# EasyEDA Pro project 毕业设计.eprj, schematic Schematic1
Create Date: 2024-03-29; Page Name: P1; Project Name: 毕业设计; Schematic Name: Schematic1; Update Date: 2024-05-28; Company: 嘉立创EDA; Page Size: A4; Version: V1.0
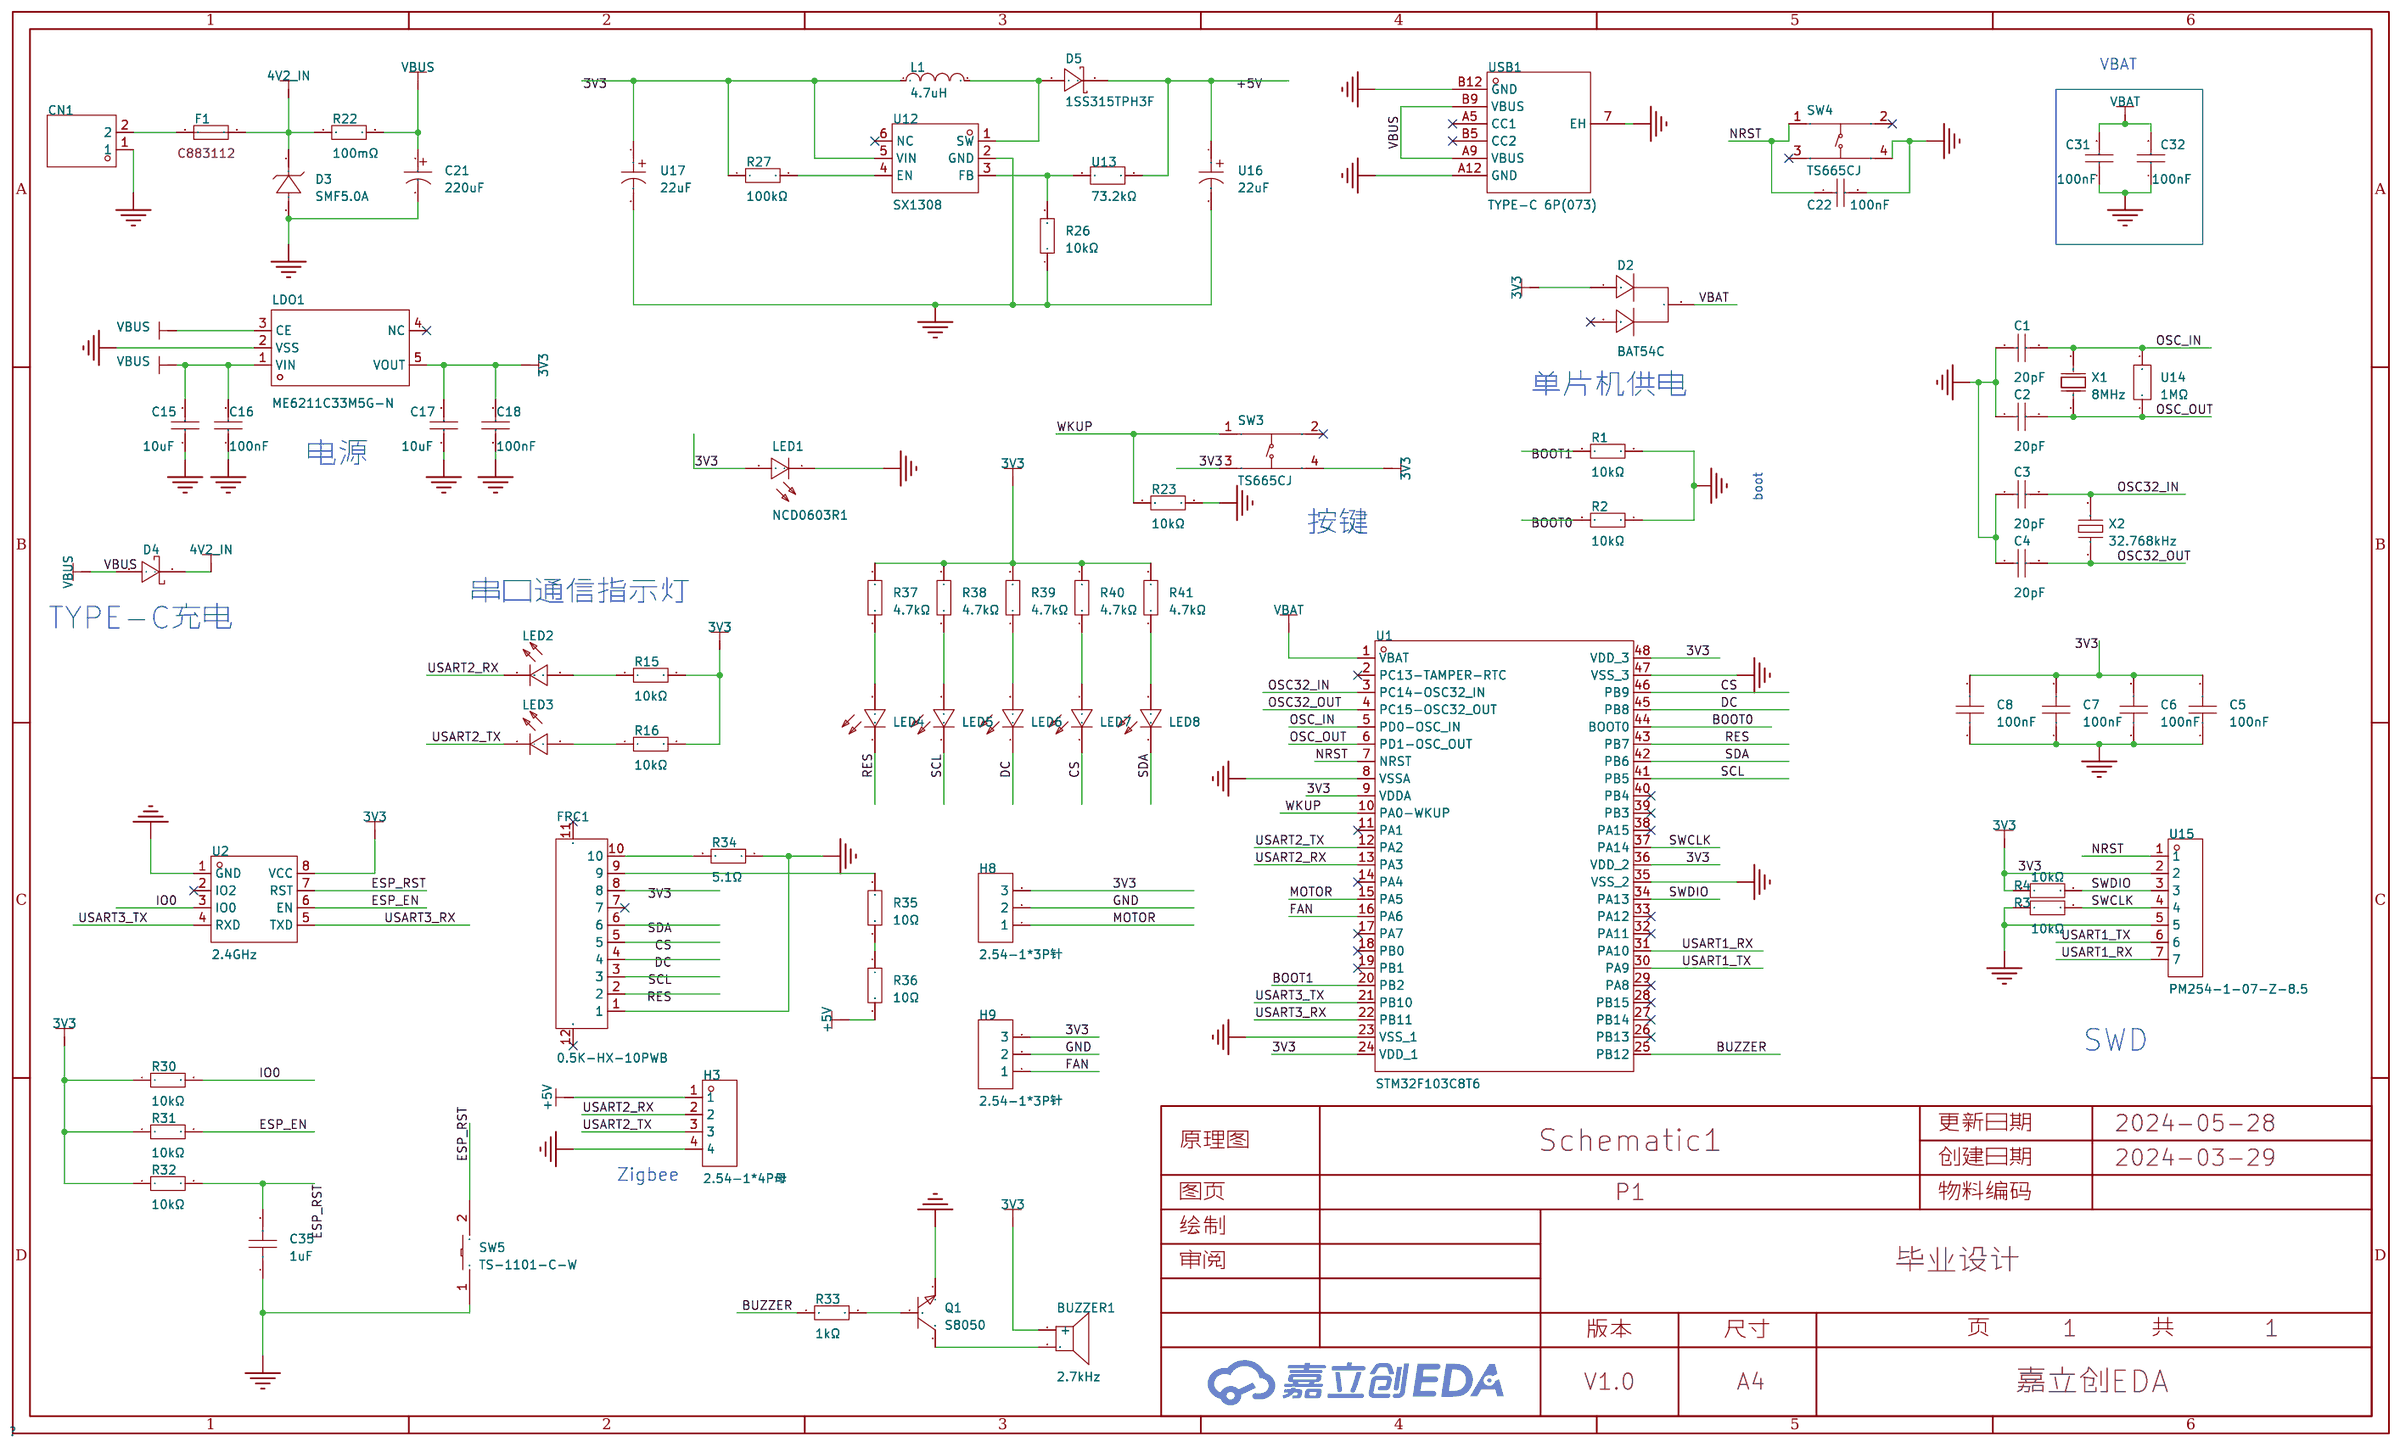
[diagram p0: schematic sheet]

## Parts
BUZZER1  2.7kHz  [BUZ-TH_BD12.0-P7.60-D0.6-FD]
C1  20pF  [C0603]
C2  20pF  [C0603]
C3  20pF  [C0603]
C4  20pF  [C0603]
C5  100nF  [C0603]
C6  100nF  [C0603]
C7  100nF  [C0603]
C8  100nF  [C0603]
C15  10uF  [C0402]
C16  100nF  [C0402]
C17  10uF  [C0402]
C18  100nF  [C0402]
C21  220uF  [CAP-TH_BD6.3-P2.50-D1.0-FD]
C22  100nF  [C0402]
C31  100nF  [C0603]
C32  100nF  [C0603]
C35  1uF  [C0603]
CN1  B2B-XH-A(LF)(SN)  [CONN-TH_B2B-XH-A-LF-SN]
D2  BAT54C  [SOT-23-3_L2.9-W1.6-P1.90-LS2.8-BR]
D3  SMF5.0A  [SOD-123FL_L2.7-W1.8-LS3.8-RD]
D4  B5819W SL  [SOD-123_L2.7-W1.6-LS3.7-RD-1]
D5  1SS315TPH3F  [SOD-323_L1.8-W1.3-LS2.5-RD]
F1  BSMD0805-100-6V  [F0805]
FPC1  0.5K-HX-10PWB  [FPC-SMD_10P-P0.50_HDGC_0.5K-HX-10PWB]
H3  2.54-1*4P母  [HDR-TH_4P-P2.54-V-F]
H8  2.54-1*3P针  [HDR-TH_3P-P2.54-V-M-1]
H9  2.54-1*3P针  [HDR-TH_3P-P2.54-V-M-1]
L1  4.7uH  [IND-SMD_L4.4-W4.2]
LDO1  ME6211C33M5G-N  [SOT-23-5_L3.0-W1.7-P0.95-LS2.8-BL]
LED1  NCD0603R1  [LED0603-RD_RED]
LED2  19-217/GHC-YR1S2/3T  [LED0603-RD]
LED3  NCD0603B1  [LED0603-RD]
LED4  NCD0603R1  [LED0603-RD_RED]
LED5  NCD0603R1  [LED0603-RD_RED]
LED6  NCD0603R1  [LED0603-RD_RED]
LED7  NCD0603R1  [LED0603-RD_RED]
LED8  NCD0603R1  [LED0603-RD_RED]
Q1  S8050  [SOT-23-3_L2.9-W1.3-P1.90-LS2.4-BR]
R1  10kΩ  [R0603]
R2  10kΩ  [R0603]
R3  10kΩ  [R0603]
R4  10kΩ  [R0603]
R15  10kΩ  [R0603]
R16  10kΩ  [R0603]
R22  100mΩ  [R0805]
R23  10kΩ  [R0603]
R26  10kΩ  [R0603]
R27  100kΩ  [R0402]
R30  10kΩ  [R0603]
R31  10kΩ  [R0603]
R32  10kΩ  [R0603]
R33  1kΩ  [R0603]
R34  5.1Ω  [R1206]
R35  10Ω  [R1206]
R36  10Ω  [R1206]
R37  4.7kΩ  [R0603]
R38  4.7kΩ  [R0603]
R39  4.7kΩ  [R0603]
R40  4.7kΩ  [R0603]
R41  4.7kΩ  [R0603]
SW3  TS665CJ  [SW-TH_4P-L6.0-W6.0-P4.50-LS6.5]
SW4  TS665CJ  [SW-TH_4P-L6.0-W6.0-P4.50-LS6.5]
SW5  TS-1101-C-W  [SW-SMD_L6.0-W3.3-LS8.0]
U1  STM32F103C8T6  [LQFP-48_L7.0-W7.0-P0.50-LS9.0-BL]
U2  2.4GHz  [WIFIM-TH_8P-L24.7-W14.4-P2.54]
U12  SX1308  [SOT-23-6_L2.9-W1.6-P0.95-LS2.8-BL]
U13  73.2kΩ  [R0603]
U14  1MΩ  [R0603]
U15  PM254-1-07-Z-8.5  [HDR-TH_7P-P2.54-V-F]
U16  22uF  [CAP-TH_BD4.0-P2.00-D0.5-FD]
U17  22uF  [CAP-TH_BD4.0-P2.00-D0.5-FD]
USB1  TYPE-C 6P(073)  [TYPE-C-SMD_TYPE-C-6P]
X1  8MHz  [CRYSTAL-SMD_L5.0-W3.2]
X2  32.768kHz  [OSC-SMD_L3.2-W1.5]

## Library data of the parts
BUZZER1 = TMB12A05_C96093: 驱动方式:有源(内含驱动线路);构造类型:电磁式;频率:2.7kHz;声压(SPL):85dB;; LCSC Part Name: TMB12A05; Supplier Part: C96093; Manufacturer: 华能; Manufacturer Part: TMB12A05; Supplier Footprint: 插件,D=12mm; JLCPCB Part Class: 扩展库; Datasheet: https://atta.szlcsc.com/upload/public/pdf/source/20230426/A4FC10532558AA232D532AB83455FBA4.pdf; Supplier: LCSC; Oscillator Circuit: 有源(内含驱动线路); Technology Type: 电磁式; Operating Voltage: 4V~8V; Sound Pressure Level (SPL): 85dB; Diameter (φD): 12mm; Height: 9.8mm
C1-C4 = CL10C200JB8NNNC: 容值:20pF;精度:±5%;额定电压:50V;材质(温度系数):C0G;; LCSC Part Name: 20pF ±5% 50V; Supplier Part: C1648; Manufacturer: SAMSUNG(三星); Supplier Footprint: 0603; JLCPCB Part Class: Basic Part; Datasheet: https://atta.szlcsc.com/upload/public/pdf/source/20160218/1457707763339.pdf; Supplier: LCSC; Tolerance: ±5%; Voltage Rated: 50V; Temperature Coefficient: C0G
C5-C8 = CC0603KRX7R9BB104: 容值:100nF;精度:±10%;额定电压:50V;材质(温度系数):X7R;; LCSC Part Name: 100nF ±10% 50V; Supplier Part: C14663; Manufacturer: YAGEO(国巨); Supplier Footprint: 0603; JLCPCB Part Class: Basic Part; Datasheet: https://atta.szlcsc.com/upload/public/pdf/source/20180910/C282072_33301C7F631E79921B82A8DAC6BCC5B3.pdf; Supplier: LCSC; Tolerance: ±10%; Voltage Rated: 50V; Temperature Coefficient: X7R
C15 C17 = CL05A106MQ5NUNC: 容值:10uF;精度:±20%;额定电压:6.3V;材质(温度系数):X5R;; LCSC Part Name: 10uF ±20% 6.3V; Supplier Part: C15525; Manufacturer: SAMSUNG(三星); Supplier Footprint: 0402; JLCPCB Part Class: Basic Part; Datasheet: https://atta.szlcsc.com/upload/public/pdf/source/20220823/2B02EE04F8F211D38A52DCB16EB6BEBA.pdf; Supplier: LCSC; Tolerance: ±20%; Voltage Rated: 6.3V; Temperature Coefficient: X5R
C16 C18 C22 = CL05B104KO5NNNC: 容值:100nF;精度:±10%;额定电压:16V;材质(温度系数):X7R;; LCSC Part Name: 100nF ±10% 16V; Supplier Part: C1525; Manufacturer: SAMSUNG(三星); Supplier Footprint: 0402; JLCPCB Part Class: Basic Part; Datasheet: https://atta.szlcsc.com/upload/public/pdf/source/20160103/1457707674891.pdf; Supplier: LCSC; Tolerance: ±10%; Voltage Rated: 16V; Temperature Coefficient: X7R
C21 = KM227M025E11RR0VH2FP0: 容值:220uF;精度:±20%;额定电压:25V;纹波电流:-;等效串联电阻:-;; LCSC Part Name: 220uF ±20% 25V; Supplier Part: C12450; Manufacturer: CX(承兴); Supplier Footprint: 插件,D6.3xL11mm; JLCPCB Part Class: Extended Part; Datasheet: https://atta.szlcsc.com/upload/public/pdf/source/20211027/06D6BA3719C264B639DC286D935D03EA.pdf; Supplier: LCSC; Tolerance: ±20%; Rated Voltage: 25V; φD: 6.3mm; L: 11mm; Lead Spacing: 2.5mm; Lifetime @ Temp: 1000hrs@105℃
C31 C32 = 0603B104K500NT: 容值:100nF;精度:±10%;额定电压:50V;材质(温度系数):X7R;; LCSC Part Name: 100nF ±10% 50V; Supplier Part: C30926; Manufacturer: FH(风华); Supplier Footprint: 0603; JLCPCB Part Class: Extended Part; Datasheet: https://atta.szlcsc.com/upload/public/pdf/source/20170923/C30926_1506149436298988724.pdf; Supplier: LCSC; Tolerance: ±10%; Voltage Rated: 50V; Temperature Coefficient: X7R
C35 = CL10A105KB8NNNC: 容值:1uF;精度:±10%;额定电压:50V;材质(温度系数):X5R;; LCSC Part Name: 1uF ±10% 50V; Supplier Part: C15849; Manufacturer: SAMSUNG(三星); Supplier Footprint: 0603; JLCPCB Part Class: 基础库; Datasheet: https://atta.szlcsc.com/upload/public/pdf/source/20160218/1457707763339.pdf; Supplier: LCSC; Tolerance: ±10%; Voltage Rated: 50V; Temperature Coefficient: X5R
CN1 = B2B-XH-A(LF)(SN): 参考系列:XH;间距:2.5mm;插针结构:1x2P;排数:1;每排PIN数:2;行距:-;安装方式:-;触头材质:黄铜;; LCSC Part Name: XH 2.5mm 1x2P; Supplier Part: C158012; Manufacturer: JST; Supplier Footprint: 插件,P=2.5mm; JLCPCB Part Class: Extended Part; Datasheet: https://atta.szlcsc.com/upload/public/pdf/source/20180319/9D0AC2122F92891443E3C996983D6D0E.pdf; Supplier: LCSC; Reference Series: XH; Pitch: 2.5mm; Pins Structure: 1x2P; Number of Rows: 1; Number of PINs Per Row: 2; Contact Material: 黄铜
D2 = BAT54C_C2135: 二极管配置:-;直流反向耐压(Vr):30V;平均整流电流(Io):200mA;正向压降(Vf):1V@100mA;; LCSC Part Name: 30V 200mA 1V@100mA; Supplier Part: C2135; Manufacturer: CJ(江苏长电/长晶); Supplier Footprint: SOT-23; JLCPCB Part Class: Extended Part; Datasheet: https://atta.szlcsc.com/upload/public/pdf/source/20140809/1457707208935.pdf; Supplier: LCSC; Reverse Voltage (Vr): 30V; Average Rectified Current (Io): 200mA; Forward Voltage (Vf@If): 1V@100mA
D3 = SMF5.0A_C908213: 极性:单向;反向截止电压(Vrwm):5V;击穿电压(最小值):6.4V;击穿电压(最大值):7.25V;反向漏电流(Ir):800uA;峰值脉冲电流(Ipp)@10/1000μs:21.7A;最大钳位电压:9.2V;; LCSC Part Name: 单向 Vrwm:5V; Supplier Part: C908213; Manufacturer: FUXINSEMI(富芯森美); Supplier Footprint: SOD-123; JLCPCB Part Class: Extended Part; Datasheet: https://atta.szlcsc.com/upload/public/pdf/source/20201023/C908211_2B6F82B5D5E79B5CF282141215A9A141.pdf; Supplier: LCSC; Polarity: 单向; Reverse Stand-Off Voltage (Vrwm): 5V; Breakdown Voltage (Min): 6.4V; Breakdown Voltage (Max): 7.25V; Reverse Leakage Current (Ir): 800uA; Peak Pulse Current (Ipp)@10/1000μs: 21.7A; Maximum Clamping Voltage: 9.2V
D4 = B5819W SL: 直流反向耐压(Vr):40V;平均整流电流(Io):1A;正向压降(Vf):600mV@1A;; LCSC Part Name: 40V 1A 600mV@1A; Supplier Part: C8598; Manufacturer: CJ(江苏长电/长晶); Supplier Footprint: SOD-123; JLCPCB Part Class: Basic Part; Datasheet: https://atta.szlcsc.com/upload/public/pdf/source/20170217/1487301580783.pdf; Supplier: LCSC; Reverse Voltage (Vr): 40V; Average Rectified Current (Io): 1A; Forward Voltage (Vf@If): 600mV@1A
D5 = 1SS315TPH3F: 二极管配置:独立式;正向压降(Vf):250mV@2mA;直流反向耐压(Vr):5V;平均整流电流(Io):30mA;; LCSC Part Name: 电压:5V 电流:30mA; Supplier Part: C146374; Manufacturer: TOSHIBA(东芝); Supplier Footprint: SC-76(SOD-323); JLCPCB Part Class: 扩展库; Datasheet: https://atta.szlcsc.com/upload/public/pdf/source/20171211/C146374_15129763897731175405.pdf; Supplier: LCSC; Diode Configuration: 独立式; Forward Voltage (Vf@If): 250mV@2mA; Reverse Voltage (Vr): 5V; Average Rectified Current (Io): 30mA
F1 = BSMD0805-100-6V: 最大电压:6V;最大电流:40A;保持电流:1A;跳闸电流:2A;; LCSC Part Name: 6V 1A 0805自恢复 300毫秒内动作; Supplier Part: C883112; Manufacturer: BHFUSE(佰宏); Supplier Footprint: 0805; JLCPCB Part Class: Extended Part; Datasheet: https://atta.szlcsc.com/upload/public/pdf/source/20220223/3FD8E8A8A3681642EAEF465E16495357.pdf; Supplier: LCSC; Operating Voltage (Max): 6V; Current Rating (Max): 40A; Hold Current: 1A; Trip Current: 2A; Power Dissipation: 500mW; Resistance - Initial (Ri) (Min): 40mΩ; Resistance - Post Trip (R1) (Max): 270mΩ; Maximum Time to Trip: 300ms; Operating Temperature: -40℃~+85℃
FPC1 = 0.5K-HX-10PWB: 锁定特性:翻盖式;触点类型:双侧触点/上下接;触点数量:10P;间距:0.5mm;安装类型:卧贴;工作温度范围:-55℃~+85℃;; LCSC Part Name: 间距:0.5mm P数:10P 翻盖式 双侧触点/上下接; Supplier Part: C2919493; Manufacturer: HDGC(华德共创); Supplier Footprint: SMD,P=0.5mm,卧贴; JLCPCB Part Class: 扩展库; Datasheet: https://atta.szlcsc.com/upload/public/pdf/source/20230106/F3A1E1364911D19E8EE51A6AD1F947C3.pdf; Supplier: LCSC; Locking Feature: 翻盖式; Contact Type: 双侧触点/上下接; Number of Contacts: 10P; Pitch: 0.5mm; Mounting Type: 卧贴; FFC, FCB Thickness: 0.3mm; Height Above Board: 1mm; Operating Temperature Range: -55℃~+85℃
H3 = 2.54-1*4P母: 插孔结构:1x4P;间距:2.54mm;行距:-;圆孔/方孔:方孔;安装类型:直插;排数:单排;总孔位数:4P;额定电流:3A;额定电压:-;插孔方向:顶部;塑高:-;触头材质:青铜;触头镀层:-;工作温度范围:-40℃~+105℃;焊接温度(最大值):-;; LCSC Part Name: 间距:2.54mm 1x4P 直插; Supplier Part: C2718488; Manufacturer: BOOMELE(博穆精密); Supplier Footprint: 插件,P=2.54mm; JLCPCB Part Class: Extended Part; Datasheet: https://atta.szlcsc.com/upload/public/pdf/source/20210301/C2718488_F4427B881E42CAA8DDB0B1C12B3A522C.pdf; Supplier: LCSC; Holes Structure: 1x4P; Pitch: 2.54mm; Circular Hole / Square Hole: 方孔; Mounting Type: 直插; Number of Rows: 单排; Number of Holes: 4P; Current Rating (Max): 3A; Holes Direction: 顶部; Contact Material: 青铜; Operating Temperature Range: -40℃~+105℃
H8 H9 = 2.54-1*3P针: 插针结构:1x3P;间距:2.54mm;行距:-;圆针/方针:方针;安装类型:直插;排数:单排;总PIN位数:3P;额定电流:3A;额定电压:-;配合针长度:-;塑高:-;端接针长度:-;触头材质:-;触头镀层:-;工作温度范围:-40℃~+105℃;颜色:黑色;; LCSC Part Name: 间距:2.54mm 1x3P 直插 方针; Supplier Part: C49257; Manufacturer: BOOMELE(博穆精密); Supplier Footprint: 插件,P=2.54mm; JLCPCB Part Class: Extended Part; Datasheet: https://atta.szlcsc.com/upload/public/pdf/source/20221018/3E9408392E35E6F57A28985E5F7BF5C9.pdf; Supplier: LCSC; Pin Structure: 1x3P; Pitch: 2.54mm; Circluar Pins/Square Pins: 方针; Mounting Type: 直插; Number of Rows: 单排; Number of Pins: 3P; Current Rating (Max): 3A; Operating Temperature Range: -40℃~+105℃; Color: 黑色
L1 = FXL0420-4R7-M: 电感值:4.7uH;精度:±20%;额定电流:2.8A;饱和电流(Isat):3A;类型:一体成型电感;; LCSC Part Name: 4.7uH ±20% 3A; Supplier Part: C167208; Manufacturer: cjiang(长江微电); Supplier Footprint: SMD,4.2x4.4mm; JLCPCB Part Class: Extended Part; Datasheet: https://atta.szlcsc.com/upload/public/pdf/source/20230516/FBADA9890E7FBE97C620F1D8B562D733.pdf; Supplier: LCSC; Tolerance: ±20%; Rated Current: 2.8A; Saturation Current (Isat): 3A; DC Resistance (DCR): 105mΩ; Type: 一体成型电感
LDO1 = ME6211C33M5G-N: 输出类型:固定;输出极性:正;最大输入电压:6V;输出电压:3.3V;输出电流:500mA;电源纹波抑制比(PSRR):70dB;; Supplier Part: C82942; Manufacturer: MICRONE(南京微盟); Supplier Footprint: SOT-23-5; JLCPCB Part Class: Extended Part; Datasheet: https://atta.szlcsc.com/upload/public/pdf/source/20170918/C82942_1505727073070976520.pdf; Supplier: LCSC; Output Type: 固定; Output Polarity: 正; Number of Outputs: 1; Maximum Input Voltage: 6V; Output Voltage: 3.3V; Dropout Voltage: 260mV@(200mA); Output Current: 500mA; Power Supply Rejection Ratio (PSRR): 70dB
LED1 LED4-LED8 = NCD0603R1_C84263: 灯头类型:-;发光颜色:红色;正向电压(VF):1.6V~2.6V;功率:65mW;正向电流:20mA;主波长:615nm~630nm;二极管配置:独立二极管;透镜颜色:无色透明透镜;色温:-;发光强度:80mcd~220mcd;发光角度:130°;载带方式:-;工作温度:-30℃~+85℃;; Supplier Part: C84263; Manufacturer: 国星光电; Supplier Footprint: 0603; JLCPCB Part Class: 扩展库; Datasheet: https://atta.szlcsc.com/upload/public/pdf/source/20200820/C84263_DABC6A75E58F576973B407FDBA283D60.pdf; Supplier: LCSC; Emitted Color: 红色; Forward Voltage (VF): 1.6V~2.6V; Power Dissipation: 65mW; Forward Current: 20mA; Dominant Wavelength: 615nm~630nm; Diode Configuration: 独立二极管; Lens Color: 无色透明透镜; Luminous Intensity: 80mcd~220mcd; Viewing Angle: 130°; Operating Temperature: -30℃~+85℃
LED2 = 19-217/GHC-YR1S2/3T: 发光颜色:翠绿;二极管配置:-;主波长:520nm~535nm;色温:-;功率:110mW;安装方式:-;; Supplier Part: C72043; Manufacturer: EVERLIGHT(亿光); Supplier Footprint: 0603; JLCPCB Part Class: Basic Part; Datasheet: https://atta.szlcsc.com/upload/public/pdf/source/20160507/1462613613780.pdf; Supplier: LCSC; Emitted Color: 翠绿; Lens Color: 无色透明; Dominant Wavelength: 520nm~535nm; Peak Wavelength: 518nm; Forward Current: 20mA; Power Dissipation: 110mW; Viewing Angle: 120°; Operating Temperature: -40℃~+85℃
LED3 = NCD0603B1: 发光颜色:蓝灯;; LCSC Part Name: 蓝灯; Supplier Part: C84266; Manufacturer: 国星光电; Supplier Footprint: 0603; JLCPCB Part Class: Extended Part; Datasheet: https://atta.szlcsc.com/upload/public/pdf/source/20200820/C84266_6A3CDBEFA72C6CAD68EDA53474ADAE6C.pdf; Supplier: LCSC; Emitted Color: 蓝灯
Q1 = S8050_C2891804: 晶体管类型:NPN;集电极电流(Ic):500mA;集射极击穿电压(Vceo):25V;功率(Pd):300mW;; LCSC Part Name: NPN 电流:500mA 耐压:25V; Supplier Part: C2891804; Manufacturer: YONGYUTAI(永裕泰); Supplier Footprint: SOT-23; JLCPCB Part Class: 扩展库; Datasheet: https://atta.szlcsc.com/upload/public/pdf/source/20210901/5347316A10609C628D4D69AE01446E5B.pdf; Supplier: LCSC; Transistor Type: NPN; Collector Current (Ic): 500mA; Collector-Emitter Breakdown Voltage (Vceo): 25V; Power Dissipation (Pd): 300mW; Collector Cut-Off Current (Icbo): 1uA; Collector-Emitter Saturation Voltage (VCE(sat)@Ic,Ib): 500mV@500mA,50mA
R1 R2 R26 R30-R32 = 0603WAF1002T5E: 电阻类型:厚膜电阻;阻值:10kΩ;精度:±1%;功率:100mW;最大工作电压:75V;温度系数:±100ppm/℃;; LCSC Part Name: 厚膜电阻 10kΩ ±1% 100mW; Supplier Part: C25804; Manufacturer: UNI-ROYAL(厚声); Supplier Footprint: 0603; JLCPCB Part Class: Basic Part; Datasheet: https://atta.szlcsc.com/upload/public/pdf/source/20200306/C422600_1E6D84923E4A46A82E41ADD87F860B5C.pdf; Supplier: LCSC; Type: 厚膜电阻; Tolerance: ±1%; Power(Watts): 100mW; Overload Voltage (Max): 75V; Temperature Coefficient: ±100ppm/℃; Operating Temperature Range: -55℃~+155℃
R3 R4 R15 R16 R23 = 0603WAF1002T5E: 电阻类型:厚膜电阻;阻值:10kΩ;精度:±1%;功率:100mW;; LCSC Part Name: 厚膜电阻 10kΩ ±1% 100mW; Supplier Part: C25804; Manufacturer: UNI-ROYAL(厚声); Supplier Footprint: 0603; JLCPCB Part Class: Basic Part; Datasheet: https://atta.szlcsc.com/upload/public/pdf/source/20200306/C422600_1E6D84923E4A46A82E41ADD87F860B5C.pdf; Supplier: LCSC; Type: 厚膜电阻; Tolerance: ±1%; Power(Watts): 100mW; Overload Voltage (Max): 75V; Temperature Coefficient: ±100ppm/℃; Operating Temperature Range: -55℃~+155℃
R22 = 0805W8F100LT5E: 阻值:100mΩ;精度:±1%;功率:125mW;; LCSC Part Name: 100mΩ ±1% 125mW; Supplier Part: C127687; Manufacturer: UNI-ROYAL(厚声); Supplier Footprint: 0805; JLCPCB Part Class: Extended Part; Datasheet: https://atta.szlcsc.com/upload/public/pdf/source/20170821/C127687_1503303433318901668.pdf; Supplier: LCSC; Tolerance: ±1%; Power(Watts): 125mW; Temperature Coefficient: ±800ppm/℃
R27 = RC0402FR-07100KL: 电阻类型:厚膜电阻;阻值:100kΩ;精度:±1%;功率:62.5mW;最大工作电压:50V;温度系数:±100ppm/℃;; LCSC Part Name: 厚膜电阻 100kΩ ±1% 62.5mW; Supplier Part: C60491; Manufacturer: YAGEO(国巨); Supplier Footprint: 0402; JLCPCB Part Class: 扩展库; Datasheet: https://atta.szlcsc.com/upload/public/pdf/source/20180927/C295883_E8D83085EA81BD7DE0B2B681138C15EE.pdf; Supplier: LCSC; Type: 厚膜电阻; Tolerance: ±1%; Power(Watts): 62.5mW; Overload Voltage (Max): 50V; Temperature Coefficient: ±100ppm/℃; Operating Temperature Range: -55℃~+155℃
R33 = 0603WAF1001T5E: 电阻类型:厚膜电阻;阻值:1kΩ;精度:±1%;功率:100mW;; LCSC Part Name: 1kΩ ±1% 100mW; Supplier Part: C21190; Manufacturer: UNI-ROYAL(厚声); Supplier Footprint: 0603; JLCPCB Part Class: Basic Part; Datasheet: https://atta.szlcsc.com/upload/public/pdf/source/20200306/C422600_1E6D84923E4A46A82E41ADD87F860B5C.pdf; Supplier: LCSC; Type: 厚膜电阻; Tolerance: ±1%; Power(Watts): 100mW; Temperature Coefficient: ±100ppm/℃; Overload Voltage (Max): 75V; Operating Temperature Range: -55℃~+155℃
R34 = 1206W4J051JT5E: 电阻类型:厚膜电阻;阻值:5.1Ω;精度:±5%;功率:250mW;最大工作电压:200V;温度系数:±400ppm/℃;; LCSC Part Name: 5.1Ω ±5% 250mW 厚膜电阻; Supplier Part: C37912; Manufacturer: UNI-ROYAL(厚声); Supplier Footprint: 1206; JLCPCB Part Class: 扩展库; Datasheet: https://atta.szlcsc.com/upload/public/pdf/source/20200306/C422600_1E6D84923E4A46A82E41ADD87F860B5C.pdf; Supplier: LCSC; Type: 厚膜电阻; Tolerance: ±5%; Power(Watts): 250mW; Overload Voltage (Max): 200V; Temperature Coefficient: ±400ppm/℃; Operating Temperature Range: -55℃~+155℃
R35 R36 = 1206W4F100JT5E: 电阻类型:厚膜电阻;阻值:10Ω;精度:±1%;功率:250mW;最大工作电压:200V;温度系数:±400ppm/℃;; LCSC Part Name: 10Ω ±1% 250mW 厚膜电阻; Supplier Part: C17903; Manufacturer: UNI-ROYAL(厚声); Supplier Footprint: 1206; JLCPCB Part Class: 基础库; Datasheet: https://atta.szlcsc.com/upload/public/pdf/source/20200306/C422600_1E6D84923E4A46A82E41ADD87F860B5C.pdf; Supplier: LCSC; Type: 厚膜电阻; Tolerance: ±1%; Power(Watts): 250mW; Overload Voltage (Max): 200V; Temperature Coefficient: ±400ppm/℃; Operating Temperature Range: -55℃~+155℃
R37-R41 = 0603WAF4701T5E: 电阻类型:厚膜电阻;阻值:4.7kΩ;精度:±1%;功率:100mW;最大工作电压:75V;温度系数:±100ppm/℃;; LCSC Part Name: 4.7kΩ ±1% 100mW 厚膜电阻; Supplier Part: C23162; Manufacturer: UNI-ROYAL(厚声); Supplier Footprint: 0603; JLCPCB Part Class: 基础库; Datasheet: https://atta.szlcsc.com/upload/public/pdf/source/20200306/C422600_1E6D84923E4A46A82E41ADD87F860B5C.pdf; Supplier: LCSC; Type: 厚膜电阻; Tolerance: ±1%; Power(Watts): 100mW; Overload Voltage (Max): 75V; Temperature Coefficient: ±100ppm/℃; Operating Temperature Range: -55℃~+155℃
SW3 SW4 = TS665CJ: 电路结构:单刀单掷;按钮形状:圆形按钮;安装方式:直插;开关长度:6mm;开关宽度:6mm;开关高度:5mm;触点电流:50mA;额定电压(DC):12V;带灯:-;机械寿命:-;; LCSC Part Name: 6*6*5mm 直插 轻触开关; Supplier Part: C393938; Manufacturer: SHOU HAN(首韩); Supplier Footprint: 插件; JLCPCB Part Class: 扩展库; Datasheet: https://atta.szlcsc.com/upload/public/pdf/source/20190521/C393938_BDABEAC600B4C55E200A80AA129B70BC.pdf; Supplier: LCSC; Circuit: 单刀单掷; Actuator Style: 圆形按钮; Mounting Style: 直插; Switch Length: 6mm; Switch Width: 6mm; Switch Height: 5mm; Contact Current: 50mA; Voltage Rating (DC): 12V
SW5 = TS-1101-C-W: 触点电流:50mA;额定电压(AC):-;额定电压(DC):12V;额定功率:-;绝缘电阻:-;电路结构:单刀单掷;安装方式:立贴;带灯:无;作用力:260gf;机械寿命:5万次;带支架:否;; LCSC Part Name: 立贴 6*3.6*2.5mm 轻触开关 一型3*6*2.5有白ZD b拉伸白色带淡绿按键 卷装; Supplier Part: C318938; Manufacturer: XKB Connectivity(中国星坤); Supplier Footprint: SMD; JLCPCB Part Class: Extended Part; Datasheet: https://atta.szlcsc.com/upload/public/pdf/source/20200227/C318938_C2E53B1EEDE37D980A33616AC086DE53.pdf; Supplier: LCSC; Contact Current: 50mA; Voltage Rating (DC): 12V; Circuit: 单刀单掷; Mounting Style: 立贴; Actuator Style: 矩形按钮; Actuator/Cap Color: 白色带淡绿; With Lamp: 无; Operating Force: 260gf; Mechanical Life: 5万次; Operating Temperature: -30℃~+85℃; Switch Length: 6mm; Switch Width: 3.6mm; Switch Height: 2.5mm; Strike Gundam: 否
U1 = STM32F103C8T6: CPU内核:CM3;程序存储容量:64KB;RAM总容量:20KB;GPIO端口数量:37;工作电压范围:2V~3.6V;CPU最大主频:72MHz;程序存储器类型:FLASH;; LCSC Part Name: STM32F103C8T6 MSL=3; Supplier Part: C8734; Manufacturer: ST(意法半导体); Supplier Footprint: LQFP-48(7x7); JLCPCB Part Class: 扩展库; Datasheet: https://atta.szlcsc.com/upload/public/pdf/source/20220812/8363ACEC51AD55ECEB84799464F7CB85.pdf; Supplier: LCSC; CPU Core: CM3; Program Storage Size: 64KB; RAM Size: 20KB; GPIO Ports Number: 37; Operating Voltage Range: 2V~3.6V; CPU Maximum Speed: 72MHz; Program Memory Type: FLASH; Operating Temperature Range: -40℃~+85℃; ADC (Bit): 12bit; Universal Serial Bus: 有; Peripheral/Function: 看门狗；DMA；看门狗；片载温度传感器; Watchdog: 有; Infrared Data Association: 有; Low-Voltage Detect: 有; Direct Memory Access: 有; Internal Oscillator: 有
U2 = ESP-01S: 核心处理器:ESP8266芯片;频率:2.4GHz;天线形式:板载PCB天线;发射功率:16dBm;接收灵敏度:-90dBm;; LCSC Part Name: 完整的802.11b/g/nWi-FiSoC模块; Supplier Part: C503582; Manufacturer: Ai-Thinker(安信可); JLCPCB Part Class: 扩展库; Datasheet: https://atta.szlcsc.com/upload/public/pdf/source/20200407/C503582_1139AF8FB42E05635FA0089E1752A536.pdf; Supplier: LCSC; Core Processor: ESP8266芯片; Support Interface: GPIO；UART；PWM; Antenna Type: 板载PCB天线; Output Power: 16dBm; Operating Voltage: 3V~3.6V; Receive  Current: 56mA; Send  Current: 170mA; Sensitivity: -90dBm; Operating Temperature: -20℃~+70℃
U12 = SX1308: 功能类型:升压型;输入电压:2V~24V;输出电压:28V;输出电流(最大值):-;; Supplier Part: C78162; Manufacturer: SX(硕芯科技); Supplier Footprint: SOT-23-6; JLCPCB Part Class: 扩展库; Datasheet: https://atta.szlcsc.com/upload/public/pdf/source/20160920/1474356679185.pdf; Supplier: LCSC; Function: 升压型; Input Voltage: 2V~24V; Output Voltage: 28V; Switching Frequency: 1.2MHz; Synchronous Rectification: 否; Number of Outputs: 1; Topology: 升压式; Switch tube (built-in/external): 内置
U13 = FRC0603F7322TS: 电阻类型:厚膜电阻;阻值:73.2kΩ;精度:±1%;功率:100mW;最大工作电压:75V;温度系数:±100ppm/℃;; LCSC Part Name: 73.2kΩ ±1% 100mW 厚膜电阻; Supplier Part: C2933257; Manufacturer: FOJAN(富捷); Supplier Footprint: 0603; JLCPCB Part Class: 扩展库; Datasheet: https://atta.szlcsc.com/upload/public/pdf/source/20211221/925EC7D7225764EE0046F22065062C87.pdf; Supplier: LCSC; Type: 厚膜电阻; Tolerance: ±1%; Power(Watts): 100mW; Overload Voltage (Max): 75V; Temperature Coefficient: ±100ppm/℃; Operating Temperature Range: -55℃~+155℃
U14 = SC0603F1004F2BNRH: 阻值:1MΩ;精度:±1%;功率:-;温度系数:±100ppm/℃;; LCSC Part Name: 1MΩ ±1%; Supplier Part: C3152128; Manufacturer: Sunway(信维通信); Supplier Footprint: 0603; JLCPCB Part Class: Extended Part; Datasheet: https://atta.szlcsc.com/upload/public/pdf/source/20220728/FFCE43BB6DF8FA16AEE331F0F4B289DE.pdf; Supplier: LCSC; Tolerance: ±1%; Temperature Coefficient: ±100ppm/℃
U15 = PM254-1-07-Z-8.5: 插孔结构:1x7P;间距:2.54mm;行距:-;圆孔/方孔:方孔;安装类型:直插;排数:单排;总孔位数:7P;额定电流:3A;额定电压:-;插孔方向:顶部;塑高:8.5mm;触头材质:铜合金;工作温度范围:-40℃~+105℃;焊接温度(最大值):260℃@5S;; LCSC Part Name: 1x7P 间距:2.54mm 直插; Supplier Part: C2897370; Manufacturer: HCTL(华灿天禄); Supplier Footprint: 插件,P=2.54mm; JLCPCB Part Class: 扩展库; Datasheet: https://atta.szlcsc.com/upload/public/pdf/source/20230609/534BE42964C679BDE98E061007C4ABD6.pdf; Supplier: LCSC; Holes Structure: 1x7P; Pitch: 2.54mm; Circular Hole / Square Hole: 方孔; Mounting Type: 直插; Number of Rows: 单排; Number of Holes: 7P; Current Rating (Max): 3A; Holes Direction: 顶部; Insulation Height: 8.5mm; Contact Material: 铜合金; Operating Temperature Range: -40℃~+105℃; Soldering Temperature(Max): 260℃@5S
U16 U17 = KM1E220M0407: 容值:22uF;精度:±20%;额定电压:25V;纹波电流:48mA@120kHz;等效串联电阻:-;; LCSC Part Name: 22uF ±20% 25V; Supplier Part: C2873975; Manufacturer: ROQANG(容强); Supplier Footprint: 插件,D4xL7mm; JLCPCB Part Class: 扩展库; Datasheet: https://atta.szlcsc.com/upload/public/pdf/source/20210825/43CC5C3A3C9845108B639C21E16A1224.pdf; Supplier: LCSC; Tolerance: ±20%; Rated Voltage: 25V; Ripple Current: 48mA@120kHz; φD: 4mm; L: 7mm; Lifetime @ Temp: 2000hrs@105℃; Operating Temperature: -40℃~+105℃
USB1 = TYPE-C 6P(073): 连接器类型:Type-C;标准:-;公母:母;端口数量:1;触点数量:6P;安装方式:卧贴;额定电流 - 电源:5A;工作温度范围:-25℃~+85℃;; LCSC Part Name: Type-C 母 卧贴; Supplier Part: C668623; Manufacturer: SHOU HAN(首韩); Supplier Footprint: SMD; JLCPCB Part Class: 扩展库; Datasheet: https://atta.szlcsc.com/upload/public/pdf/source/20200618/C668623_A4B260DED7AC1949BAC6AE39E9F4CD80.pdf; Supplier: LCSC; Connector Type: Type-C; Gender: 母; Number of Ports: 1; Number of Contacts: 6P; Mounting Style: 卧贴; Current Rating - Power (Max): 5A; Operating Temperature Range: -25℃~+85℃
X1 = X50328MSB2GI: 晶振类型:贴片晶振;频率:8MHz;常温频差:±10ppm;外接负载电容:20pF;频率稳定度(全温):±20ppm;; LCSC Part Name: 8MHz ±10ppm 20pF YSX530GA; Supplier Part: C115962; Manufacturer: YXC(扬兴晶振); Supplier Footprint: SMD5032; JLCPCB Part Class: 基础库; Datasheet: https://atta.szlcsc.com/upload/public/pdf/source/20240329/44922B0AF7B60E58E9B66993B6077277.pdf; Supplier: LCSC; Crystal Type: 贴片晶振; Normal temperature Frequency Tolerance: ±10ppm; External load capacitor: 20pF; Frequency Stability(Full temperature range): ±20ppm; Operating Temperature: -40℃~+85℃
X2 = X321532768KGD2SI: 晶振类型:贴片晶振;频率:32.768kHz;常温频差:±20ppm;外接负载电容:12.5pF;频率稳定度(全温):-;; LCSC Part Name: 32.768kHz ±20ppm 12.5pF; Supplier Part: C620155; Manufacturer: YXC(扬兴晶振); Supplier Footprint: SMD3215-2P; JLCPCB Part Class: 扩展库; Datasheet: https://atta.szlcsc.com/upload/public/pdf/source/20240329/3A7650FD985DD0DE85694D3785AB4916.pdf; Supplier: LCSC; Crystal Type: 贴片晶振; Normal temperature Frequency Tolerance: ±20ppm; External load capacitor: 12.5pF; Operating Temperature: -40℃~+85℃

## Nets
3V3: BUZZER1.1(+) C5.2 C6.2 C7.2 C8.2 C17.2 C18.2 D2.1(A1) FPC1.8 H8.3 H9.3 L1.1 LDO1.5(VOUT) LED1.2(A) R4.1 R15.2 R16.2 R27.1 R30.1 R31.1 R32.1 R37.2 R38.2 R39.2 R40.2 R41.2 SW3.3(C) SW3.4(D) U1.9(VDDA) U1.24(VDD_1) U1.36(VDD_2) U1.48(VDD_3) U2.8(VCC) U12.5(VIN) U15.2 U17.1
4V2_IN: D3.1(C) D4.1(-) F1.2 R22.1
+5V: D5.1(K) H3.1 R36.2 U13.2 U16.1
GND: C1.1 C2.1 C3.1 C4.1 C5.1 C6.1 C7.1 C8.1 C15.1 C16.1 C17.1 C18.1 C21.2 C22.2 C31.1 C32.1 C35.1 CN1.1 D3.2(A) FPC1.1 H3.4 H8.2 H9.2 LDO1.2(VSS) LED1.1(K) Q1.2(E) R1.1 R2.1 R3.1 R23.2 R26.1 R34.1 SW4.4(D) SW5.1 U1.8(VSSA) U1.23(VSS_1) U1.35(VSS_2) U1.47(VSS_3) U2.1(GND) U12.2(GND) U15.5 U16.2 U17.2 USB1.7(EH) USB1.A12(GND) USB1.B12(GND)
VBAT: C31.2 C32.2 D2.3(K) U1.1(VBAT)
VBUS: C15.2 C16.2 C21.1 D4.2(+) LDO1.1(VIN) LDO1.3(CE) R22.2 USB1.A9(VBUS) USB1.B9(VBUS)
BOOT0: R2.2 U1.44(BOOT0)
BOOT1: R1.2 U1.20(PB2)
BUZZER: R33.1 U1.25(PB12)
CS: FPC1.5 LED7.1(K) U1.46(PB9)
DC: FPC1.4 LED6.1(K) U1.45(PB8)
ESP_EN: R31.2 U2.6(EN)
ESP_RST: C35.2 R32.2 SW5.2 U2.7(RST)
FAN: H9.1 U1.16(PA6)
IO0: R30.2 U2.3(IO0)
MOTOR: H8.1 U1.15(PA5)
NRST: C22.1 SW4.1(A) U1.7(NRST) U15.1
OSC32_IN: C3.2 U1.3(PC14-OSC32_IN) X2.2
OSC32_OUT: C4.2 U1.4(PC15-OSC32_OUT) X2.1
OSC_IN: C1.2 U1.5(PD0-OSC_IN) U14.2 X1.2(OSC2)
OSC_OUT: C2.2 U1.6(PD1-OSC_OUT) U14.1 X1.1(OSC1)
RES: FPC1.2 LED4.1(K) U1.43(PB7)
SCL: FPC1.3 LED5.1(K) U1.41(PB5)
SDA: FPC1.6 LED8.1(K) U1.42(PB6)
SWCLK: R3.2 U1.37(PA14) U15.4
SWDIO: R4.2 U1.34(PA13) U15.3
USART1_RX: U1.31(PA10) U15.7
USART1_TX: U1.30(PA9) U15.6
USART2_RX: H3.2 LED2.1(C) U1.13(PA3)
USART2_TX: H3.3 LED3.1(-) U1.12(PA2)
USART3_RX: U1.22(PB11) U2.5(TXD)
USART3_TX: U1.21(PB10) U2.4(RXD)
WKUP: R23.1 SW3.1(A) U1.10(PA0-WKUP)
$1N2237: CN1.2 F1.1
$1N2248: R27.2 U12.4(EN)
$1N2251: D5.2(A) L1.2 U12.1(SW)
$1N2252: R26.2 U12.3(FB) U13.1
$1N6365: LED2.2(A) R15.1
$1N6366: LED3.2(+) R16.1
$1N8183: Q1.1(B) R33.2
$1N8188: BUZZER1.2 Q1.3(C)
$1N12182: FPC1.10 R34.2
$1N12860: FPC1.9 R35.1
$1N13353: LED4.2(A) R37.1
$1N13356: LED5.2(A) R38.1
$1N13362: LED6.2(A) R39.1
$1N13365: LED7.2(A) R40.1
$1N13368: LED8.2(A) R41.1
$1N24150: R35.2 R36.1

Not connected (* = marked no-connect by the designer): D2 2(A2)*; FPC1 7* 11* 12*; LDO1 4(NC)*; SW3 2(B)*; SW4 2(B)* 3(C)*; U1 2(PC13-TAMPER-RTC)* 11(PA1)* 14(PA4)* 17(PA7)* 18(PB0)* 19(PB1)* 26(PB13)* 27(PB14)* 28(PB15)* 29(PA8)* 32(PA11)* 33(PA12)* 38(PA15)* 39(PB3)* 40(PB4)*; U2 2(IO2)*; U12 6(NC)*; USB1 A5(CC1)* B5(CC2)*

## Notes on the sheet
- VBAT
- 单片机供电
- 电源
- boot
- 按键
- 串口通信指示灯
- TYPE-C充电
- SWD
- Zigbee
